# EAGLE design hv4layerFV2 (EAGLE 6.6.0)
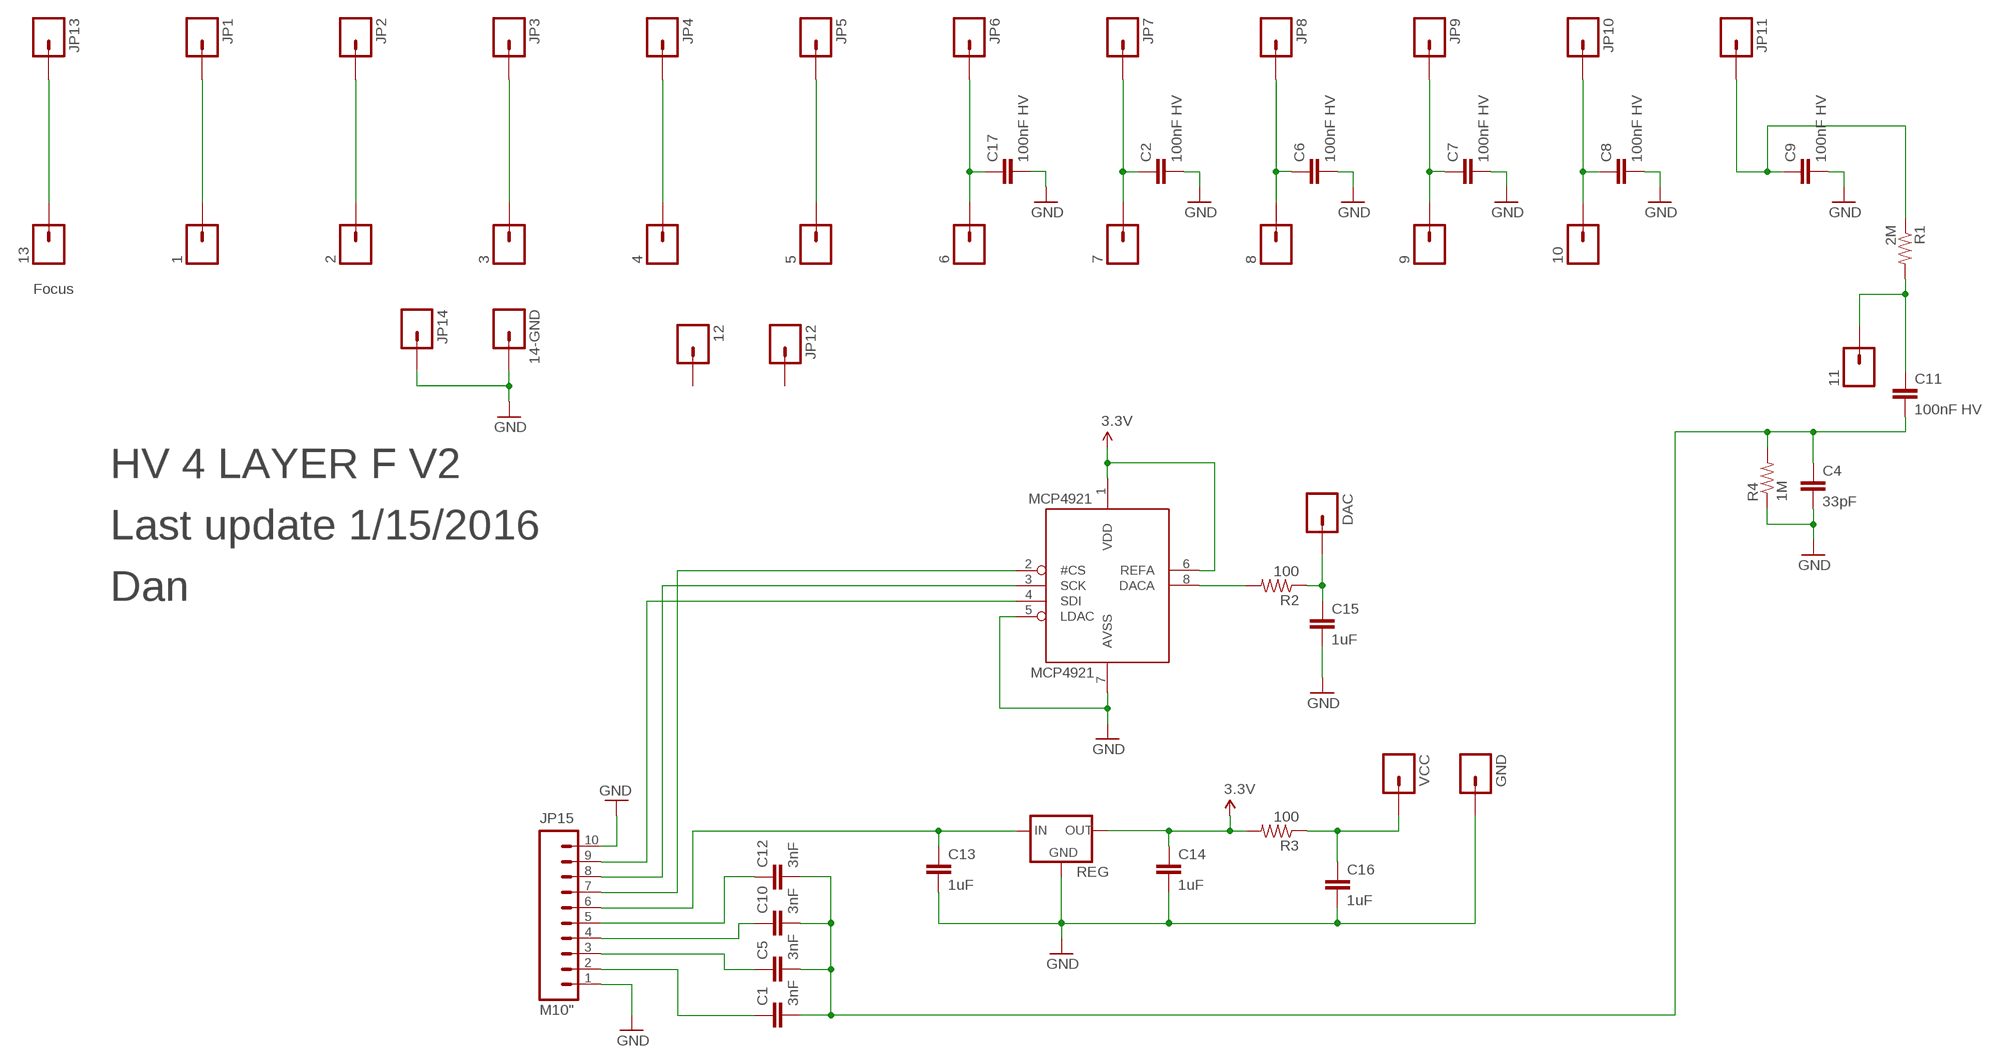
[diagram p0: schematic, sheet 1]

## Parts
1  M01PTH  [1X01]
2  M01PTH  [1X01]
3  M01PTH  [1X01]
4  M01PTH  [1X01]
5  M01PTH  [1X01]
6  M01PTH  [1X01]
7  M01PTH  [1X01]
8  M01PTH  [1X01]
9  M01PTH  [1X01]
10  M01PTH  [1X01]
11  M01PTH  [1X01]
12  M01PTH  [1X01]
13  M01PTH  [1X01]
14-GND  M01PTH  [1X01]
C1  3nF  CAP0805  [0805]
C2  100nF HV  C-EUC1812K  [C1812K]
C4  33pF  CAP0805  [0805]
C5  3nF  CAP0805  [0805]
C6  100nF HV  C-EUC1812K  [C1812K]
C7  100nF HV  C-EUC1812K  [C1812K]
C8  100nF HV  C-EUC1812K  [C1812K]
C9  100nF HV  C-EUC1812K  [C1812K]
C10  3nF  CAP0805  [0805]
C11  100nF HV  C-EUC1812K  [C1812K]
C12  3nF  CAP0805  [0805]
C13  1uF  CAP0805  [0805]
C14  1uF  CAP0805  [0805]
C15  1uF  CAP0805  [0805]
C16  1uF  CAP0805  [0805]
C17  100nF HV  C-EUC1812K  [C1812K]
DAC  M01PTH  [1X01]
GND  M01PTH  [1X01]
JP1  M01PTH  [1X01]
JP2  M01PTH  [1X01]
JP3  M01PTH  [1X01]
JP4  M01PTH  [1X01]
JP5  M01PTH  [1X01]
JP6  M01PTH  [1X01]
JP7  M01PTH  [1X01]
JP8  M01PTH  [1X01]
JP9  M01PTH  [1X01]
JP10  M01PTH  [1X01]
JP11  M01PTH  [1X01]
JP12  M01PTH  [1X01]
JP13  M01PTH  [1X01]
JP14  M01PTH  [1X01]
JP15  M10"  [1X10]
MCP4921  MCP4921D  [SO08]
R1  2M  RESISTOR0805-RES  [0805]
R2  100  RESISTOR0805-RES  [0805]
R3  100  RESISTOR0805-RES  [0805]
R4  1M  RESISTOR0805-RES  [0805]
REG  XC63FPM  [SOT23]
VCC  M01PTH  [1X01]

## Nets
3.3V: C14.1 MCP4921.1(VDD) MCP4921.6(REFA) R3.2 REG.2(OUT)
5V: C13.1 JP15.6 REG.3(IN)
#CS: JP15.7 MCP4921.2(#CS)
CH0: C1.1 JP15.2
CH1: C5.1 JP15.3
CH2: C10.1 JP15.4
CH3: C12.1 JP15.5
GND: 14-GND.1 C2.2 C4.2 C6.2 C7.2 C8.2 C9.2 C13.2 C14.2 C15.2 C16.2 C17.2 GND.1 JP14.1 JP15.1 JP15.10 MCP4921.5(LDAC) MCP4921.7(AVSS) R4.1 REG.1(GND)
N$1: 11.1 C11.1 R1.2
N$3: 8.1 C6.1 JP8.1
N$4: 13.1 JP13.1
N$5: 9.1 C7.1 JP9.1
N$7: 10.1 C8.1 JP10.1
N$8: C9.1 JP11.1 R1.1
N$12: MCP4921.8(DACA) R2.2
N$13: C15.1 DAC.1 R2.1
N$14: C16.1 R3.1 VCC.1
N$15: 7.1 C2.1 JP7.1
N$18: 6.1 C17.1 JP6.1
N$19: 5.1 JP5.1
N$21: 4.1 JP4.1
N$22: 3.1 JP3.1
N$26: 2.1 JP2.1
N$39: 1.1 JP1.1
PIN3: C1.2 C4.1 C5.2 C10.2 C11.2 C12.2 R4.2
SCK: JP15.8 MCP4921.3(SCK)
SDI: JP15.9 MCP4921.4(SDI)
Unconnected: 12.1 JP12.1

## Notes on the sheet
- Focus
- HV 4 LAYER F V2
- Last update 1/15/2016
- Dan

## Library data of the parts
1-13 14-GND DAC GND JP1-JP14 VCC = SparkFun-Connectors:M01: Header 1 Standard 1-pin 0.1" header. Use with straight break away headers (SKU : PRT-00116), right angle break away headers (PRT-00553), swiss pins (PRT-00743), machine pins (PRT-00117), and female headers (PRT-00115).
C1 C4 C5 C10 C12-C16 = SparkFun-Capacitors:CAP: Capacitor Standard 0603 ceramic capacitor, and 0.1" leaded capacitor.
C2 C6-C9 C11 C17 = rcl:C-EU: CAPACITOR, European symbol
JP15 = SparkFun-Connectors:M10: Header 10 Standard 10-pin 0.1" header. Use with straight break away headers (SKU : PRT-00116), right angle break away headers (PRT-00553), swiss pins (PRT-00743), machine pins (PRT-00117), and female headers (PRT-00115).
MCP4921 = adafruit:MCP4921
R1-R4 = SparkFun-Resistors:RESISTOR: Resistor Basic schematic elements and footprints for 0603, 1206, and PTH resistors.
REG = v-reg:XC63FP: Positiv Voltage Regulators www.torex.co.jp/english/product/pro02/pdf/0201_xc62fp.pdf

## Board
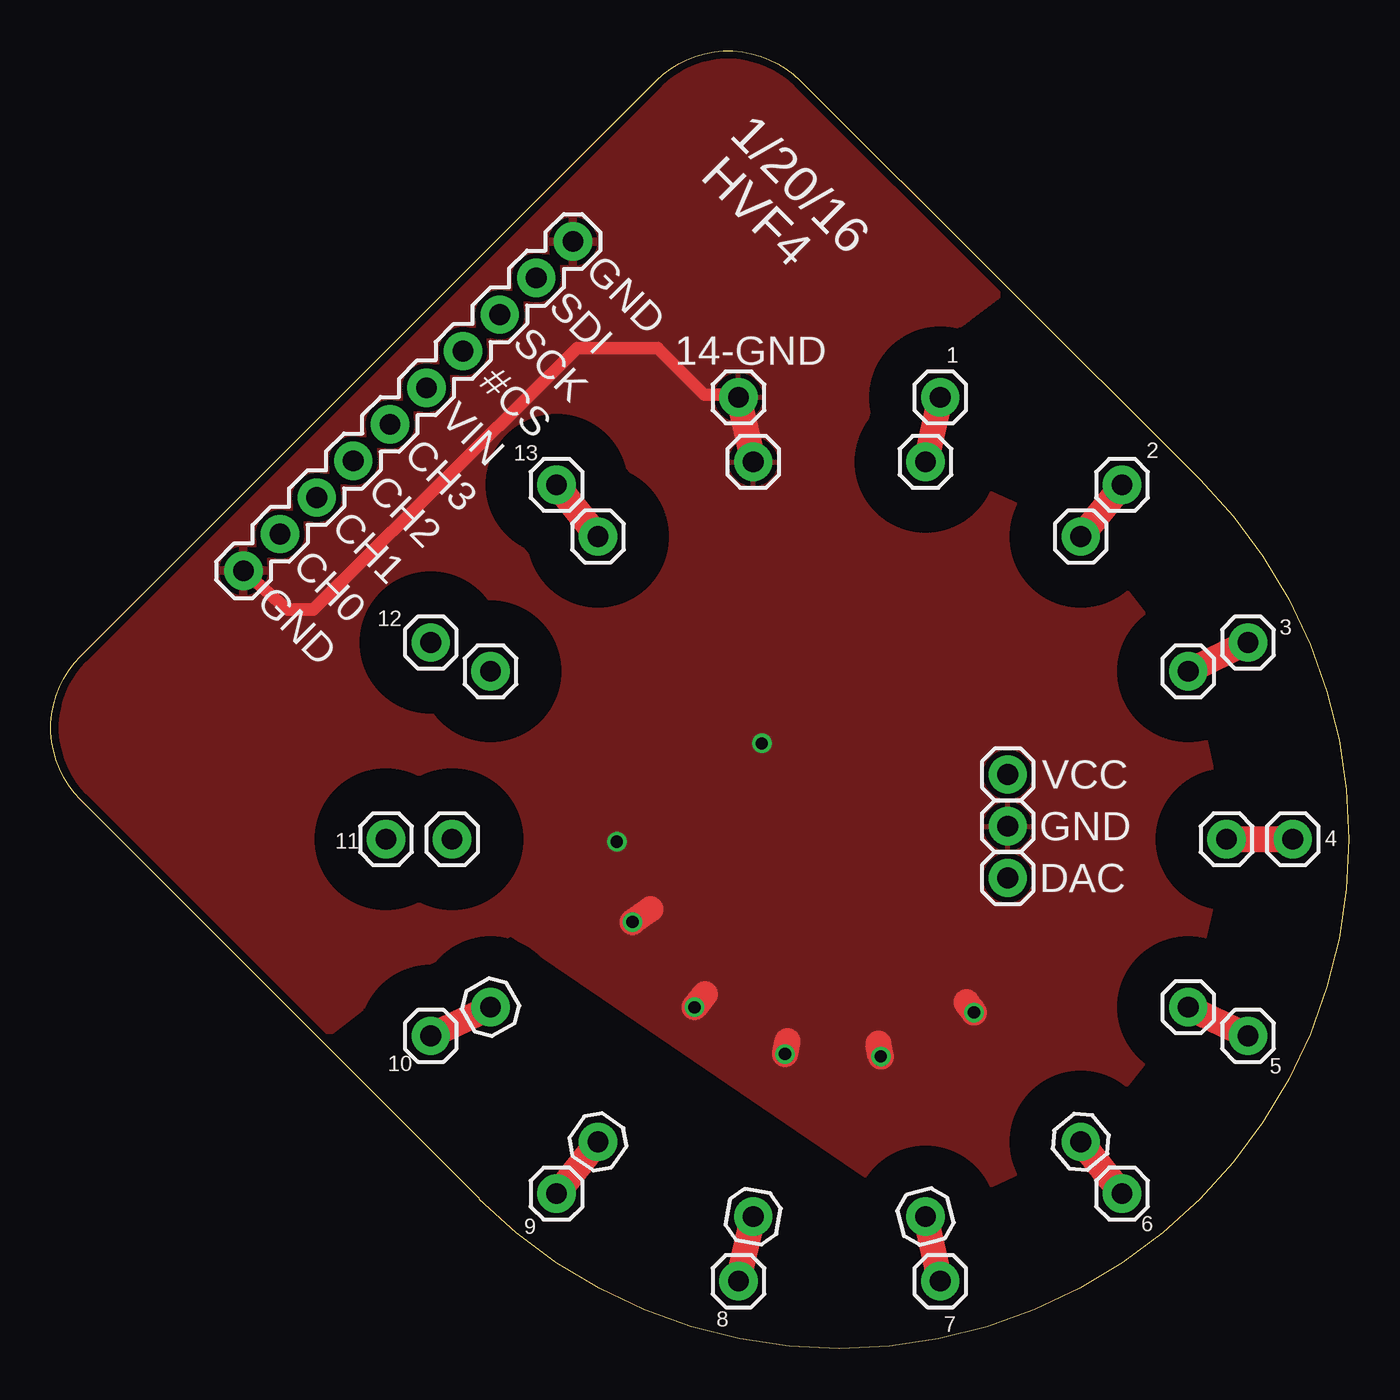
[diagram p1: board, top side]
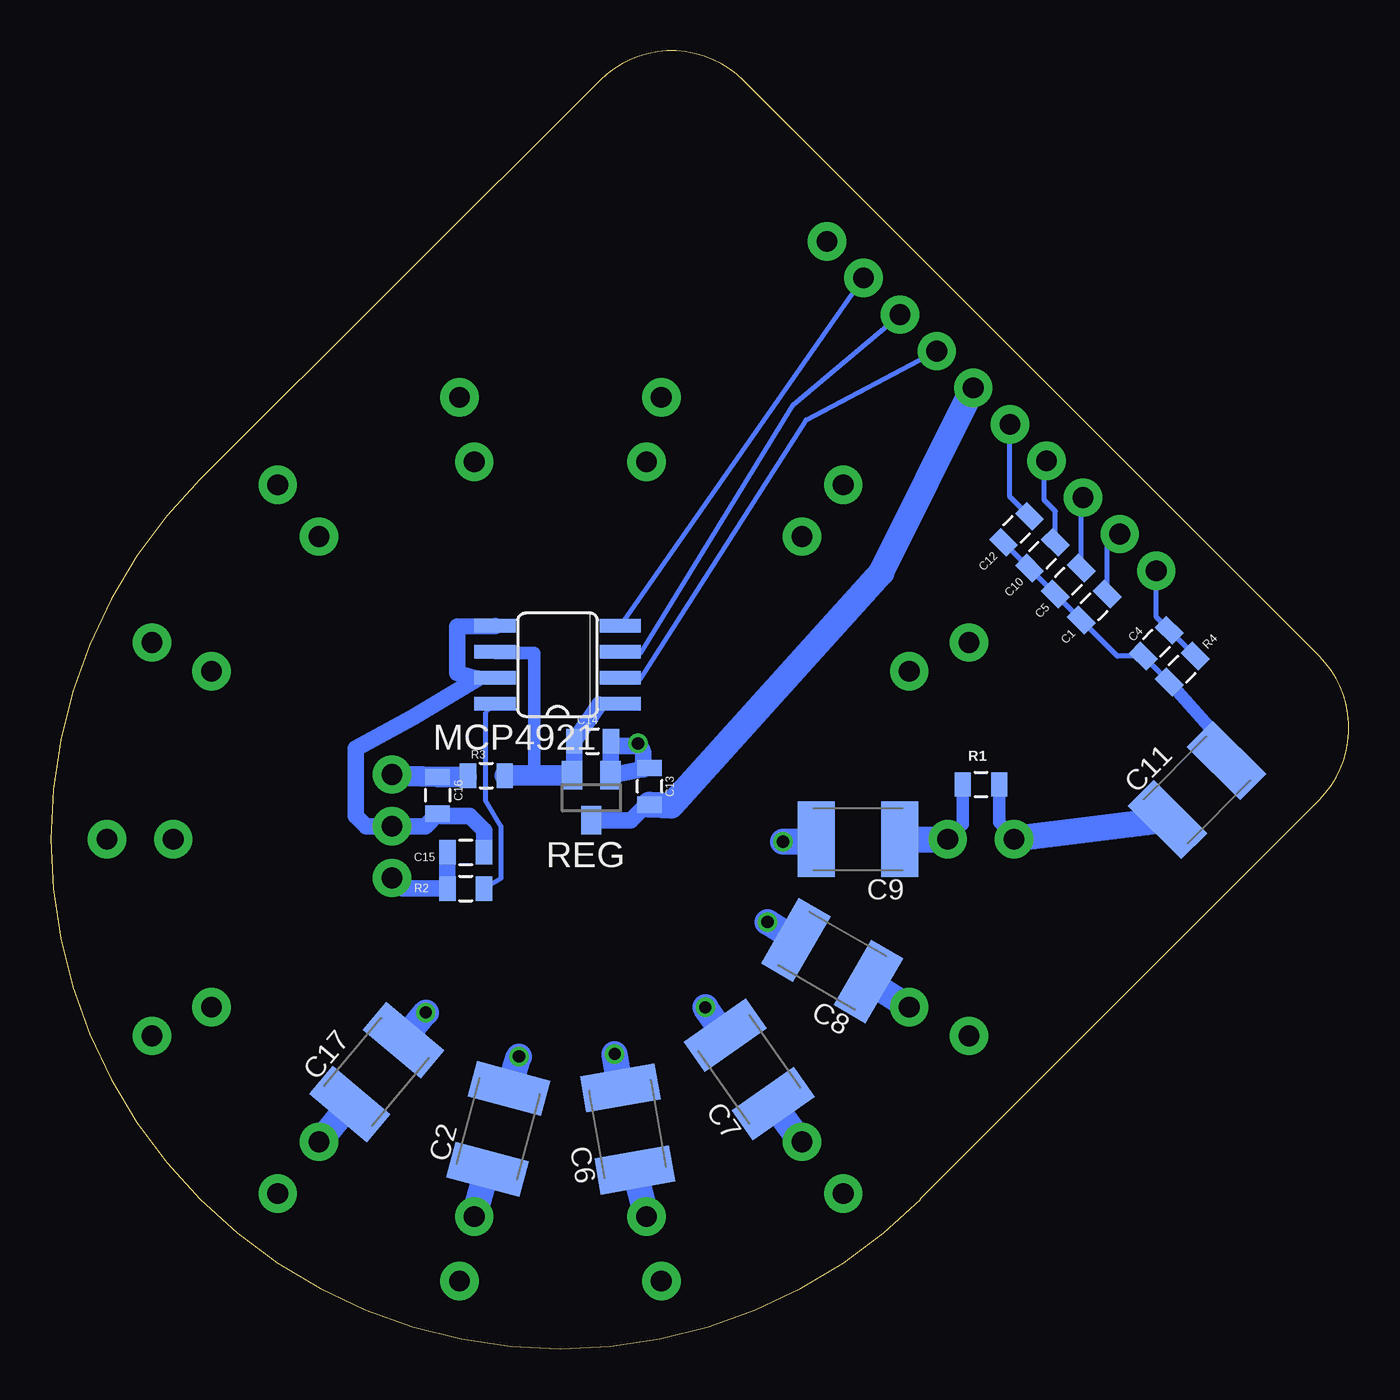
[diagram p2: board, bottom side, seen from below]

Size 63.69 x 63.7 mm. Coordinates in mm from the lower left corner, seen from the top.
Outline: 21.01,7.32 arc180 56.36,42.68 36.77,62.24 arc90 29.69,62.24 1.46,34 arc90 1.46,26.93 21.04,7.35
Copper layers (1*16): Top 0.0356mm / dielectric 1.5011mm / Bottom 0.0356mm
Design rules "oshpark": minimum track width 6mil, minimum drill 13mil, track to track 6mil, track to pad 6mil, pad to pad 6mil, via to via 6mil, smd to smd 6mil, copper to edge 15mil, drill to drill 6mil, minimum pad ring 7mil, minimum via ring 7mil, stop-mask expansion 3mil, vias tented up to drill 0mil, thermal gap 10mil

### Footprints (pad centres in the part's own frame; a part is rotated, then mirrored left to right if it is on the bottom)
1X01 = drill 1.016 pad 1.88: 1 0,0
0805 = smd 0.8 x 1.2: 1 -0.9,0; 2 0.9,0
C1812K = smd 1.8 x 3.7: 1 -2.05,0; 2 2.05,0
1X10 = drill 1.016 pad 1.88: 1 0,0; 2 2.54,0; 3 5.08,0; 4 7.62,0; 5 10.16,0; 6 12.7,0; 7 15.24,0; 8 17.78,0; 9 20.32,0; 10 22.86,0
SO08 = smd 0.66 x 2.032: 1 -1.905,-3.073; 2 -0.635,-3.073; 3 0.635,-3.073; 4 1.905,-3.073; 5 1.905,3.073; 6 0.635,3.073; 7 -0.635,3.073; 8 -1.905,3.073
SOT23 = smd 1 x 1.4: 1 -0.95,-1.1; 2 0.95,-1.1; 3 0,1.1

### Placement (x,y rotation side)
1  43.64,46.69 0 top
2  52.56,42.4 0 top
3  58.73,34.65 0 top
4  60.94,25 0 top
5  58.73,15.35 0 top
6  52.56,7.6 0 top
7  43.64,3.31 0 top
8  33.73,3.31 0 top
9  24.81,7.6 0 top
10  18.64,15.35 0 top
11  16.44,25 0 top
12  18.64,34.65 0 top
13  24.81,42.4 0 top
14-GND  33.73,46.69 0 top
C1  12.5,36.4 225 bottom
C2  41.74,10.78 75 bottom
C4  9.45,34.62 45 bottom
C5  13.77,37.67 225 bottom
C6  35.39,10.78 100 bottom
C7  29.42,13.7 125 bottom
C8  25.36,19.04 150 bottom
C9  24.09,25.01 180 bottom
C10  15.04,38.94 225 bottom
C11  7.45,27.42 45 bottom
C12  16.31,40.21 225 bottom
C13  34.31,27.6 90 bottom
C14  37.11,29.82 0 bottom
C15  43.33,24.36 0 bottom
C16  44.71,27.16 270 bottom
C17  47.71,13.58 50 bottom
DAC  46.95,23.1 0 top
GND  46.95,25.64 0 top
JP1  42.91,43.52 0 top
JP2  50.53,39.86 0 top
JP3  55.8,33.24 0 top
JP4  57.69,25 0 top
JP5  55.8,16.76 0 top
JP6  50.53,10.15 130 top
JP7  42.91,6.48 105 top
JP8  34.46,6.48 80 top
JP9  26.84,10.15 55 top
JP10  21.57,16.76 30 top
JP11  19.69,25 0 top
JP12  21.57,33.24 0 top
JP13  26.84,39.86 0 top
JP14  34.46,43.52 0 top
JP15  9.45,38.18 45 top
MCP4921  38.82,33.57 90 bottom
R1  18.05,27.69 0 bottom
R2  43.33,22.58 0 bottom
R3  42.32,28.12 0 bottom
R4  8.18,33.35 225 bottom
REG  37.17,27.04 180 bottom
VCC  46.95,28.18 0 top

### Tracks (layer width: path | path; a pad name or v marks a point on that pad's centre or on a via)
3.3V
  Bottom 0.178: 35.83,31.74 MCP4921.1
  Bottom 0.61: 38.01,28.31 REG.2 | R3.2 39.96,28.12 39.96,34.15 41.9,34.15 MCP4921.6 | 36.79,31.61 MCP4921.1
  Bottom 0.813: 38.01,28.31 C14.1 36.79,31.61
  Bottom 1.016: R3.2 REG.2
5V
  Bottom 0.178: C13.1 34.45,26.7 | 37.1,25.91 REG.3
  Bottom 0.813: 34.45,26.7 35.23,25.91 37.1,25.91
  Bottom 1.27: C13.1 33.26,26.66 22.94,38.09 JP15.6
#CS
  Bottom 0.254: MCP4921.2 34.75,32.88 26.63,45.58 JP15.7
CH0
  Bottom 0.254: C1.1 11.86,39.36 JP15.2
CH1
  Bottom 0.178: 13.13,41.68 JP15.3
  Bottom 0.254: C5.1 13.13,41.68
CH2
  Bottom 0.178: 14.94,43.46 JP15.4
  Bottom 0.254: C10.1 14.4,41.1 14.94,41.64 14.94,43.46
CH3
  Bottom 0.254: C12.1 16.63,41.81 JP15.5
GND  (via drill 0.6, 0.6 pad 0.61)
  Top 0.406: 33.7,46.69 14-GND.1
  Top 0.61: JP15.1 11.61,36.28 12.88,36.28 25.83,49.1 29.77,49.1 32.05,46.82 33.58,46.82 33.7,46.69
  Top 1.27: 14-GND.1 JP14.1 | v28.53,20.94 29.42,21.58 | v31.58,16.75 32.09,17.39 | v36.02,14.46 36.15,15.1 | v40.72,14.34 40.6,14.97 | v45.29,16.5 44.91,17
  Bottom 0.178: 41.97,33.01 MCP4921.7
  Bottom 0.254: R4.1 C4.2 9.45,35.9 JP15.1 | 42.75,32.88 41.97,33.01
  Bottom 0.305: 44.6,26.15 C16.2
  Bottom 0.61: 36.22,29.61 36.11,29.72 C14.2 arc-90 35.97,29.58 | C13.2 arc90 34.62,28.44 | 34.63,28.43 34.25,28.43
  Bottom 0.813: 36.22,29.61 REG.1 34.62,28.44 | C16.2 45.33,25.64 GND.1 48.22,25.64 48.72,26.15 48.72,29.45 45.93,30.97 42.75,32.88 43.75,33.16 43.75,35.44 MCP4921.5 | C15.2 42.43,25.44 43.14,26.15 44.6,26.15 | 35.97,29.58 35.01,29.58 | 35.01,29.58 arc90 34.63,29.2 34.63,28.43 | v34.88,29.7 35.01,29.58
  Bottom 1.27: C8.2 v28.53,20.94 | C7.2 v31.58,16.75 | C6.2 v36.02,14.46 | C2.2 v40.72,14.34 | C17.2 v45.29,16.5 | C9.2 arc90 26.26,24.88 v27.77,24.88
  pour Top (isolate 0.254): 12.91,14.97 15.2,16.75 8.59,31.61 22.69,46.47 33.99,50.41 41.74,50.79 44.53,50.28 46.56,51.8 45.04,55.1 33.74,66.79 -2.08,31.1 11.77,15.73
  pour Top (isolate 0.254): 42.88,32.75 50.63,31.99 51.14,20.31 42.75,18.02
  pour Top (isolate 2.54): 43.01,43.42 50.63,39.99 55.96,33.13 57.74,25.01 55.84,16.75 50.5,10.02 42.88,6.46 22.56,20.31 12.53,14.97 -2.71,30.47 32.85,65.65 45.29,54.09
N$1
  Bottom 0.178: 16.38,25.05 11.1
  Bottom 0.61: R1.2 17.15,25.82 16.38,25.05
  Bottom 1.27: 16.38,25.05 C11.1
N$3
  Top 1.27: 8.1 JP8.1
  Bottom 1.27: JP8.1 C6.1
N$4
  Top 1.27: 13.1 JP13.1
N$5
  Top 1.27: 9.1 JP9.1
  Bottom 0.61: JP9.1 26.88,10.15
  Bottom 1.27: 26.88,10.15 C7.1
N$7
  Top 1.27: 10.1 JP10.1
  Bottom 1.27: JP10.1 C8.1
N$8
  Bottom 0.406: 19.9,24.78 JP11.1 19.66,25.03
  Bottom 0.61: R1.1 18.95,25.74 19.66,25.03
  Bottom 1.27: C9.1 arc-90 C9.1 JP11.1
N$12
  Bottom 0.178: MCP4921.8 42.37,31.18
  Bottom 0.254: 42.37,31.18 42.37,26.91 41.61,25.64 41.61,23.1 41.63,23.09 R2.2
N$13
  Bottom 0.813: DAC.1 46.42,22.58 R2.1 C15.1
N$14
  Bottom 0.305: 43.28,28.06 R3.1
  Bottom 1.016: 43.28,28.06 C16.1 arc6 VCC.1
N$15
  Top 1.27: 7.1 JP7.1
  Bottom 1.27: JP7.1 C2.1
N$18
  Top 0.61: JP6.1 50.12,10.02
  Top 1.27: 6.1 JP6.1
  Bottom 1.27: C17.1 JP6.1
N$19
  Top 1.27: 5.1 JP5.1
N$21
  Top 1.27: 4.1 JP4.1
N$22
  Top 1.27: 3.1 JP3.1
N$26
  Top 1.27: 2.1 JP2.1
N$39
  Top 1.27: 1.1 JP1.1
PIN3
  Bottom 0.254: R4.2 C4.1 11.35,33.99 C1.2 C5.2 C10.2 C12.2
  Bottom 0.61: C11.2 arc90 6.65,30.29 R4.2
SCK
  Bottom 0.254: MCP4921.3 34.75,34.15 27.26,46.34 JP15.8
SDI
  Bottom 0.254: MCP4921.4 JP15.9

### Text on the board
tPlace: 1/20/16 | HVF4
tNames: GND | SDI | SCK | #CS | VIN | CH3 | CH2 | CH1 | CH0 | GND | 3